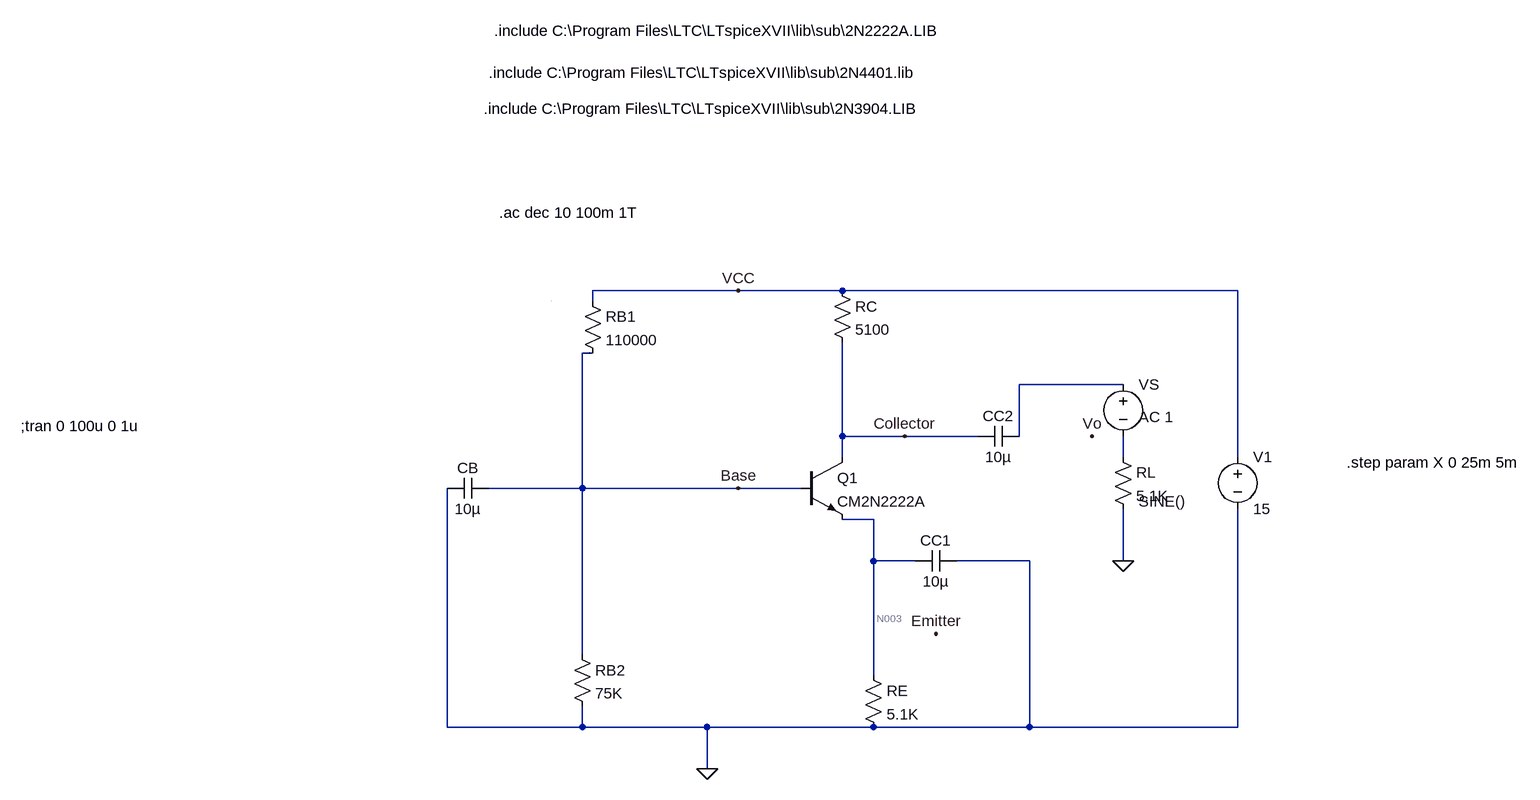
[diagram p0: schematic mp2 task3 d).asc]
mp2 task3 d).asc, the LTspice schematic file:
Version 4
SHEET 1 3216 804
WIRE 288 -16 64 -16
WIRE 448 -16 288 -16
WIRE 1056 -16 448 -16
WIRE 64 0 64 -16
WIRE 64 80 48 80
WIRE 880 128 720 128
WIRE 448 208 448 64
WIRE 544 208 448 208
WIRE 656 208 544 208
WIRE 720 208 720 128
WIRE 448 240 448 208
WIRE 880 240 880 208
WIRE 1056 240 1056 -16
WIRE 48 288 48 80
WIRE 48 288 -96 288
WIRE 288 288 48 288
WIRE 384 288 288 288
WIRE 496 336 448 336
WIRE 496 400 496 336
WIRE 560 400 496 400
WIRE 736 400 624 400
WIRE 880 400 880 320
WIRE 48 544 48 288
WIRE 496 576 496 400
WIRE -160 656 -160 288
WIRE 48 656 48 624
WIRE 48 656 -160 656
WIRE 240 656 48 656
WIRE 496 656 240 656
WIRE 736 656 736 400
WIRE 736 656 496 656
WIRE 1056 656 1056 320
WIRE 1056 656 736 656
WIRE 240 720 240 656
WIRE 0 0 0 0
FLAG 240 720 0
FLAG 288 -16 VCC
FLAG 592 512 Emitter
FLAG 880 400 0
FLAG 544 208 Collector
FLAG 288 288 Base
FLAG 832 208 Vo
SYMBOL res 48 -16 R0
SYMATTR InstName RB1
SYMATTR Value 110000
SYMBOL res 432 -32 R0
SYMATTR InstName RC
SYMATTR Value 5100
SYMBOL res 32 528 R0
SYMATTR InstName RB2
SYMATTR Value 75K
SYMBOL npn 384 240 R0
SYMATTR InstName Q1
SYMATTR Value CM2N2222A
SYMBOL res 480 560 R0
SYMATTR InstName RE
SYMATTR Value 5.1K
SYMBOL cap -96 272 R90
WINDOW 0 0 32 VBottom 2
WINDOW 3 32 32 VTop 2
SYMATTR InstName CB
SYMATTR Value 10µ
SYMBOL cap 720 192 R90
WINDOW 0 0 32 VBottom 2
WINDOW 3 32 32 VTop 2
SYMATTR InstName CC2
SYMATTR Value 10µ
SYMBOL res 864 224 R0
SYMATTR InstName RL
SYMATTR Value 5.1K
SYMBOL voltage 880 112 R0
WINDOW 3 24 196 Left 2
WINDOW 123 24 66 Left 2
WINDOW 39 0 0 Left 0
SYMATTR Value SINE()
SYMATTR Value2 AC 1
SYMATTR InstName VS
SYMBOL voltage 1056 224 R0
WINDOW 123 0 0 Left 0
WINDOW 39 0 0 Left 0
SYMATTR InstName V1
SYMATTR Value 15
SYMBOL cap 624 384 R90
WINDOW 0 0 32 VBottom 2
WINDOW 3 32 32 VTop 2
SYMATTR InstName CC1
SYMATTR Value 10µ
TEXT -104 -296 Left 2 !.include C:\\Program Files\\LTC\\LTspiceXVII\\lib\\sub\\2N3904.LIB
TEXT -96 -352 Left 2 !.include C:\\Program Files\\LTC\\LTspiceXVII\\lib\\sub\\2N4401.lib
TEXT -88 -416 Left 2 !.include C:\\Program Files\\LTC\\LTspiceXVII\\lib\\sub\\2N2222A.LIB
TEXT -80 -136 Left 2 !.ac dec 10 100m 1T
TEXT -816 192 Left 2 !;tran 0 100u 0 1u
TEXT 1224 248 Left 2 !.step param X 0 25m 5m

The netlist it stands for:
* mp2 task3 d).asc
RB1 VCC Base 110000
RC VCC Collector 5100
RB2 Base 0 75K
Q1 Collector Base N003 0 CM2N2222A
RE N003 0 5.1K
CB Base 0 10µ
CC2 N001 Collector 10µ
RL N002 0 5.1K
VS N001 N002 SINE() AC 1
V1 VCC 0 15
CC1 0 N003 10µ
.model NPN NPN
.model PNP PNP
.lib standard.bjt
.include C:\Program Files\LTC\LTspiceXVII\lib\sub\2N3904.LIB
.include C:\Program Files\LTC\LTspiceXVII\lib\sub\2N4401.lib
.include C:\Program Files\LTC\LTspiceXVII\lib\sub\2N2222A.LIB
.ac dec 10 100m 1T
;tran 0 100u 0 1u
.step param X 0 25m 5m
.backanno
.end

* Results of the author's LTspice run, read from the files saved beside the schematic
* Operating Point (first step), zero values left out:
*   V(vcc) = 15 V
*   V(base) = 5.809 V
*   V(collector) = 9.823 V
*   V(n003) = 5.208 V
*   Ic(Q1) = 1.015 mA
*   Ib(Q1) = 6.091 µA
*   Ie(Q1) = -1.021 mA
*   I(Re) = 1.021 mA
*   I(Rb2) = 77.46 µA
*   I(Rc) = 1.015 mA
*   I(Rb1) = 83.55 µA
*   I(V1) = -1.099 mA
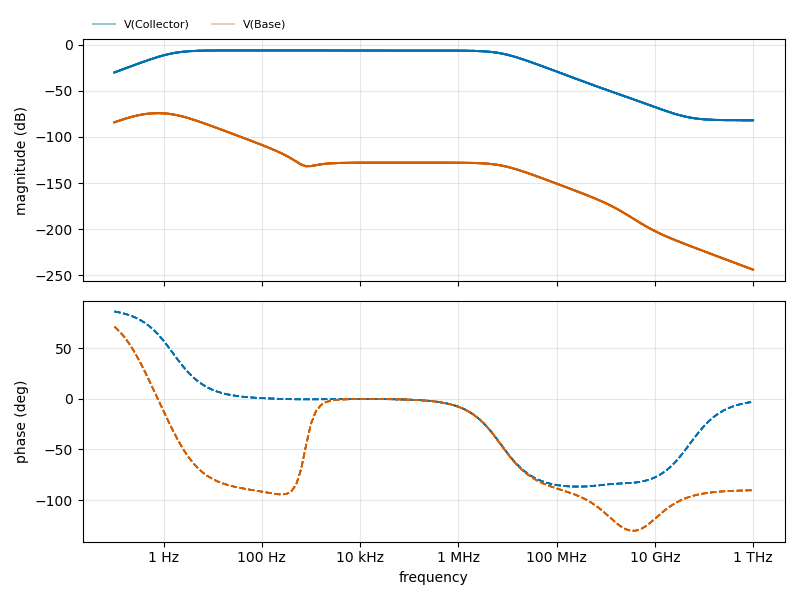
[diagram p1: AC Analysis of mp2 task3 d).asc, plotted from the saved traces]
* AC Analysis, 6 runs:
*   V(Collector) [x=0]: -29.92 dB at 100 mHz, -81.86 dB at 1 THz, peak -6.03 dB at 63.1 Hz, 3 dB below the peak at 1.562 Hz and 6.973 MHz
*   V(Collector) [x=0.005]: -29.92 dB at 100 mHz, -81.86 dB at 1 THz, peak -6.03 dB at 63.1 Hz, 3 dB below the peak at 1.562 Hz and 6.973 MHz
*   V(Collector) [x=0.01]: -29.92 dB at 100 mHz, -81.86 dB at 1 THz, peak -6.03 dB at 63.1 Hz, 3 dB below the peak at 1.562 Hz and 6.973 MHz
*   V(Collector) [x=0.015]: -29.92 dB at 100 mHz, -81.86 dB at 1 THz, peak -6.03 dB at 63.1 Hz, 3 dB below the peak at 1.562 Hz and 6.973 MHz
*   V(Collector) [x=0.02]: -29.92 dB at 100 mHz, -81.86 dB at 1 THz, peak -6.03 dB at 63.1 Hz, 3 dB below the peak at 1.562 Hz and 6.973 MHz
*   V(Collector) [x=0.025]: -29.92 dB at 100 mHz, -81.86 dB at 1 THz, peak -6.03 dB at 63.1 Hz, 3 dB below the peak at 1.562 Hz and 6.973 MHz
*   V(Base) [x=0]: -84.05 dB at 100 mHz, -244.09 dB at 1 THz, peak -74.16 dB at 794.3 mHz, 3 dB below the peak at 265.7 mHz and 2.189 Hz
*   V(Base) [x=0.005]: -84.05 dB at 100 mHz, -244.09 dB at 1 THz, peak -74.16 dB at 794.3 mHz, 3 dB below the peak at 265.7 mHz and 2.189 Hz
*   V(Base) [x=0.01]: -84.05 dB at 100 mHz, -244.09 dB at 1 THz, peak -74.16 dB at 794.3 mHz, 3 dB below the peak at 265.7 mHz and 2.189 Hz
*   V(Base) [x=0.015]: -84.05 dB at 100 mHz, -244.09 dB at 1 THz, peak -74.16 dB at 794.3 mHz, 3 dB below the peak at 265.7 mHz and 2.189 Hz
*   V(Base) [x=0.02]: -84.05 dB at 100 mHz, -244.09 dB at 1 THz, peak -74.16 dB at 794.3 mHz, 3 dB below the peak at 265.7 mHz and 2.189 Hz
*   V(Base) [x=0.025]: -84.05 dB at 100 mHz, -244.09 dB at 1 THz, peak -74.16 dB at 794.3 mHz, 3 dB below the peak at 265.7 mHz and 2.189 Hz